# Altium schematic sheet lpc11c14_33.SchDoc
size A4
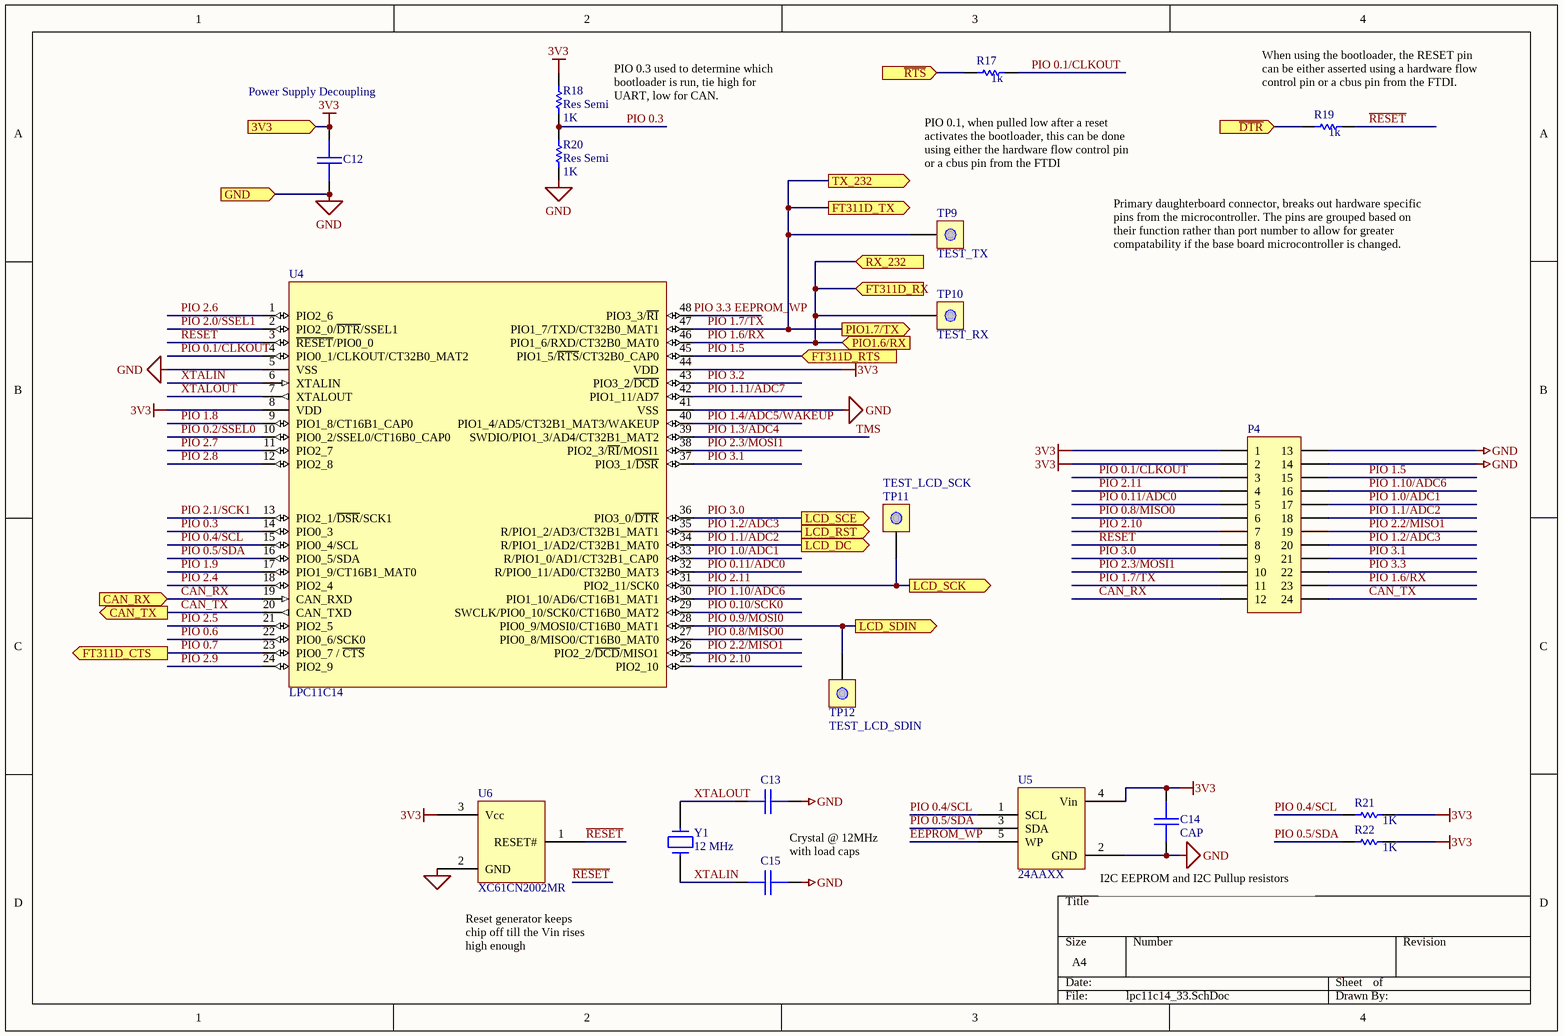
[diagram p0: lpc11c14_33.SchDoc]

## Parts
C12  CAP  [0603]  (value not drawn)
C13  CAP  [0603]  (value not drawn)
C14  CAP  [0603]
C15  CAP  [0603]  (value not drawn)
P4  Header 12X2A  [HDR2X12_CEN]  (value not drawn)
R17  value 1k  [0603]  (hidden comment: Res Semi)
R18  Res Semi  value 1K  [0603]
R19  value 1k  [0603]  (hidden comment: Res Semi)
R20  Res Semi  value 1K  [0603]
R21  value 1K  [0603]  (hidden comment: Res Semi)
R22  value 1K  [0603]  (hidden comment: Res Semi)
TP9  TEST_TX  [TESTPOINT]
TP10  TEST_RX  [TESTPOINT]
TP11  TEST_LCD_SCK  [TESTPOINT]
TP12  TEST_LCD_SDIN  [TESTPOINT]
U4  LPC11C14  [QFP48]
U5  24AAXX  [SOT23-5]
U6  XC61CN2002MR  [SOT23-3]
Y1  12 MHz  [HC49/4H]

## Ports
3V3 (in), CAN_RX (in), CAN_TX (out), FT311D_CTS (out), FT311D_RTS (in), FT311D_RX (in), FT311D_TX (out), GND (in), LCD_DC (out), LCD_RST (out), LCD_SCE (out), LCD_SCK (out), LCD_SDIN (out), PIO1.6/RX (in), PIO1.7/TX (out), RX_232 (in), TX_232 (out), ~{DTR} (in), ~{RTS} (in)

## Nets
3V3: C12.1 C14.1 P4.1 P4.2 R18.2 R21.2 R22.2 U4.8(VDD) U4.44(VDD) U5.4(Vin) U6.3(Vcc) ; port 3V3
GND: C12.2 C13.2 C14.2 C15.2 P4.13 P4.14 R20.1 U4.5(VSS) U4.41(VSS) U5.2(GND) U6.2(GND) ; port GND
~{DTR}: R19.1 ; port ~{DTR}
~{RTS}: R17.1 ; port ~{RTS}
CAN_RX: P4.12 U4.19(CAN_RXD) ; port CAN_RX
CAN_TX: P4.24 U4.20(CAN_TXD) ; port CAN_TX
EEPROM_WP: P4.22 U4.48(PIO3_3/~{RI}) U5.5(WP)  [also labelled PIO 3.3]
PIO 0.1/CLKOUT: P4.3 R17.2 U4.4(PIO0_1/CLKOUT/CT32B0_MAT2)
PIO 0.2/SSEL0: U4.10(PIO0_2/SSEL0/CT16B0_CAP0)
PIO 0.3: R18.1 R20.2 U4.14(PIO0_3)
PIO 0.4/SCL: R21.1 U4.15(PIO0_4/SCL) U5.1(SCL)
PIO 0.5/SDA: R22.1 U4.16(PIO0_5/SDA) U5.3(SDA)
PIO 0.6: U4.22(PIO0_6/SCK0)
PIO 0.7: U4.23(PIO0_7_/_~{CTS}) ; port FT311D_CTS
PIO 0.8/MISO0: P4.6 U4.27(PIO0_8/MISO0/CT16B0_MAT0)
PIO 0.9/MOSI0: TP12.0(TP) U4.28(PIO0_9/MOSI0/CT16B0_MAT1) ; port LCD_SDIN
PIO 0.10/SCK0: U4.29(SWCLK/PIO0_10/SCK0/CT16B0_MAT2)
PIO 0.11/ADC0: P4.5 U4.32(R/PIO0_11/AD0/CT32B0_MAT3)
PIO 1.0/ADC1: P4.17 U4.33(R/PIO1_0/AD1/CT32B1_CAP0)
PIO 1.1/ADC2: P4.18 U4.34(R/PIO1_1/AD2/CT32B1_MAT0) ; port LCD_DC
PIO 1.2/ADC3: P4.20 U4.35(R/PIO1_2/AD3/CT32B1_MAT1) ; port LCD_RST
PIO 1.3/ADC4: U4.39(SWDIO/PIO1_3/AD4/CT32B1_MAT2)  [also labelled TMS]
PIO 1.4/ADC5/WAKEUP: U4.40(PIO1_4/AD5/CT32B1_MAT3/WAKEUP)
PIO 1.5: P4.15 U4.45(PIO1_5/~{RTS}/CT32B0_CAP0) ; port FT311D_RTS
PIO 1.6/RX: P4.23 TP10.0(TP) U4.46(PIO1_6/RXD/CT32B0_MAT0) ; port PIO1.6/RX, port FT311D_RX, port RX_232
PIO 1.7/TX: P4.11 TP9.0(TP) U4.47(PIO1_7/TXD/CT32B0_MAT1) ; port PIO1.7/TX, port FT311D_TX, port TX_232
PIO 1.8: U4.9(PIO1_8/CT16B1_CAP0)
PIO 1.9: U4.17(PIO1_9/CT16B1_MAT0)
PIO 1.10/ADC6: P4.16 U4.30(PIO1_10/AD6/CT16B1_MAT1)
PIO 1.11/ADC7: U4.42(PIO1_11/AD7)
PIO 2.0/SSEL1: U4.2(PIO2_0/~{DTR}/SSEL1)
PIO 2.1/SCK1: U4.13(PIO2_1/~{DSR}/SCK1)
PIO 2.2/MISO1: P4.19 U4.26(PIO2_2/~{DCD}/MISO1)
PIO 2.3/MOSI1: P4.10 U4.38(PIO2_3/~{RI}/MOSI1)
PIO 2.4: U4.18(PIO2_4)
PIO 2.5: U4.21(PIO2_5)
PIO 2.6: U4.1(PIO2_6)
PIO 2.7: U4.11(PIO2_7)
PIO 2.8: U4.12(PIO2_8)
PIO 2.9: U4.24(PIO2_9)
PIO 2.10: P4.7 U4.25(PIO2_10)
PIO 2.11: P4.4 TP11.0(TP) U4.31(PIO2_11/SCK0) ; port LCD_SCK
PIO 3.0: P4.9 U4.36(PIO3_0/~{DTR}) ; port LCD_SCE
PIO 3.1: P4.21 U4.37(PIO3_1/~{DSR})
PIO 3.2: U4.43(PIO3_2/~{DCD})
~{RESET}: P4.8 R19.2 U4.3(~{RESET}/PIO0_0) U6.1(RESET#)
XTALIN: C15.1 U4.6(XTALIN) Y1.1
XTALOUT: C13.1 U4.7(XTALOUT) Y1.2

## Notes on the sheet
- (near C12) Power Supply Decoupling
- PIO 0.3 used to determine which bootloader is run, tie high for UART, low for CAN.
- (near R19) When using the bootloader, the RESET pin can be either asserted using a hardware flow control pin or a cbus pin from the FTDI.
- Text
- (near R17) PIO 0.1, when pulled low after a reset activates the bootloader, this can be done using either the hardware flow control pin or a cbus pin from the FTDI
- Primary daughterboard connector, breaks out hardware specific pins from the microcontroller. The pins are grouped based on their function rather than port number to allow for greater compatability if the base board microcontroller is changed.
- Crystal @ 12MHz with load caps
- I2C EEPROM and I2C Pullup resistors
- (near U6) Reset generator keeps chip off till the Vin rises high enough

## Library data of the parts
C12-C15 = CAP: Capacitor
P4 = Header 12X2A: Header, 12-Pin, Dual row; LatestRevisionDate: 17-Jul-2002; LatestRevisionNote: Re-released for DXP Platform.; Publisher: Altium Limited
R17-R22 = Res Semi: Semiconductor Resistor; Published: 8-Jun-2000; LatestRevisionDate: 17-Jul-2002; LatestRevisionNote: Re-released for DXP Platform.; PackageReference: AXIAL-0.5; Publisher: Altium Limited; PackageDescription: Axial Device, Thru-Hole; 2 Leads; 0.5 in Pin Spacing
TP9-TP12 = TEST: TEST POINT
U4 = LPC11C14_Full: NXP LPC11C14 Microcontroller; Farnell: NA
U5 = 24AAXX: I2C EEPROM for SOT23-5 package
U6 = XC61F: SOT23 reset generator; Needed?: Farnell; Farnell: 3605486; Farnell Price: 1.74
Y1 = CRYSTAL: Needed?: RS; RS: 693-8803; RS Price: 0.95